# EAGLE design node (EAGLE 7.7.0)
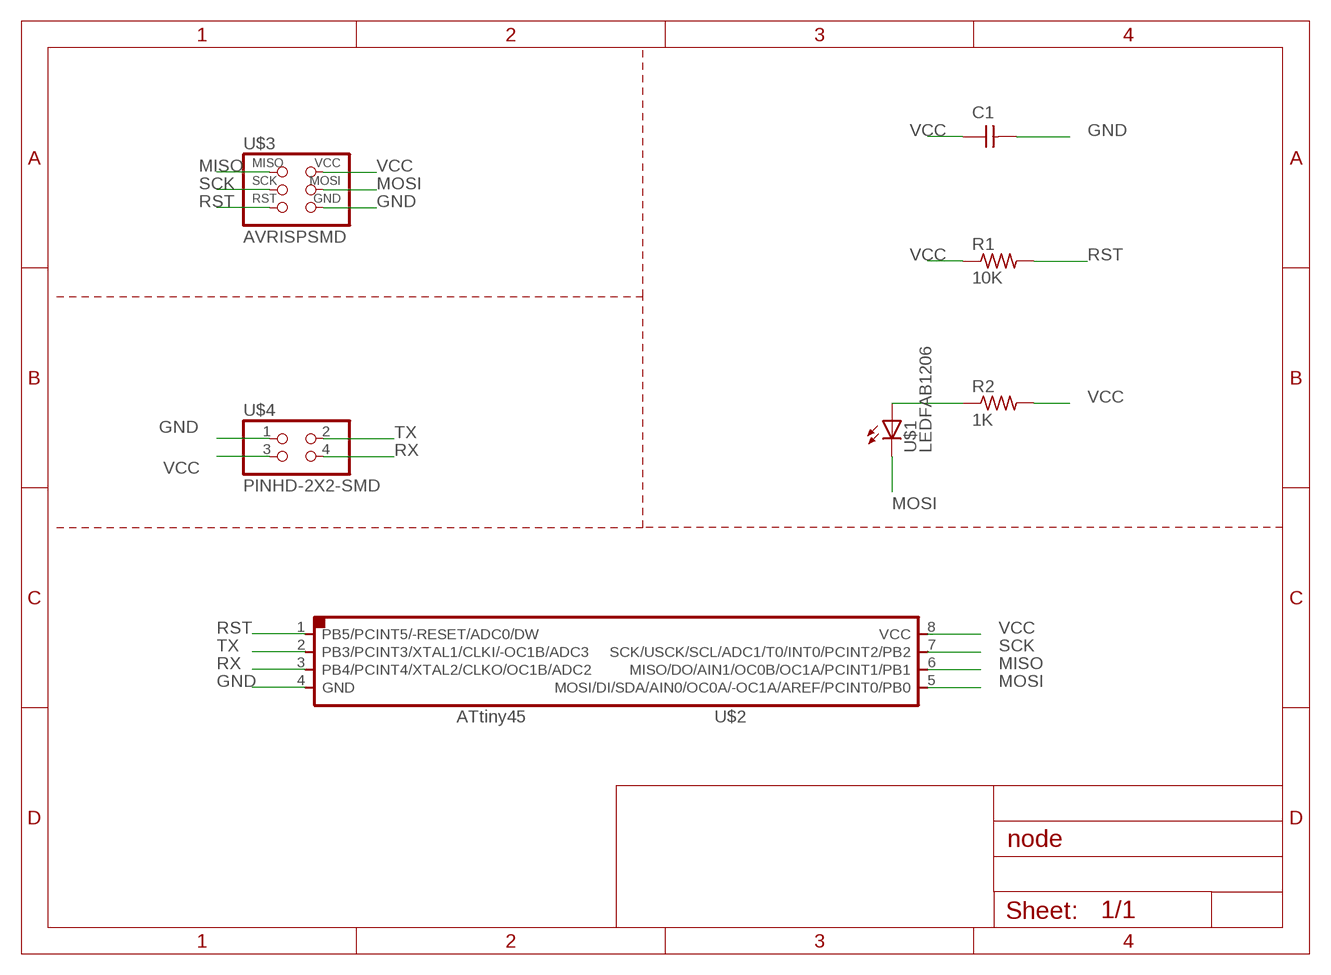
[diagram p0: schematic, sheet 1]

## Parts
C1  CAP-UNPOLARIZED  [C1206]
R1  10K  RES-US1206FAB  [R1206FAB]
R2  1K  RES-US1206FAB  [R1206FAB]
U$1  LEDFAB1206  [LED1206FAB]
U$2  ATTINY45SI  [SOIC8]
U$3  AVRISPSMD  [2X03SMD]
U$4  PINHD-2X2-SMD  [2X02SMD]

## Nets
GND: C1.2 U$2.4(GND) U$3.6(GND) U$4.1
MISO: U$2.6(MISO/DO/AIN1/OC0B/OC1A/PCINT1/PB1) U$3.1(MISO)
MOSI: U$1.2(C) U$2.5(MOSI/DI/SDA/AIN0/OC0A/-OC1A/AREF/PCINT0/PB0) U$3.4(MOSI)
N$1: R2.1 U$1.1(A)
RST: R1.2 U$2.1(PB5/PCINT5/-RESET/ADC0/DW) U$3.5(RST)
RX: U$2.3(PB4/PCINT4/XTAL2/CLKO/OC1B/ADC2) U$4.4
SCK: U$2.7(SCK/USCK/SCL/ADC1/T0/INT0/PCINT2/PB2) U$3.3(SCK)
TX: U$2.2(PB3/PCINT3/XTAL1/CLKI/-OC1B/ADC3) U$4.2
VCC: C1.1 R1.1 R2.2 U$2.8(VCC) U$3.2(VCC) U$4.3

## Library data of the parts
C1 = fab:CAP-UNPOLARIZED
R1 R2 = fab:RES-US: Resistor (US Symbol) Variants with postfix FAB are widened to allow the routing of internal traces
U$1 = fab:LED: LED
U$2 = fab:ATTINY45
U$3 = fab:AVRISP
U$4 = fab:PINHD-2X2-SMD

## Board
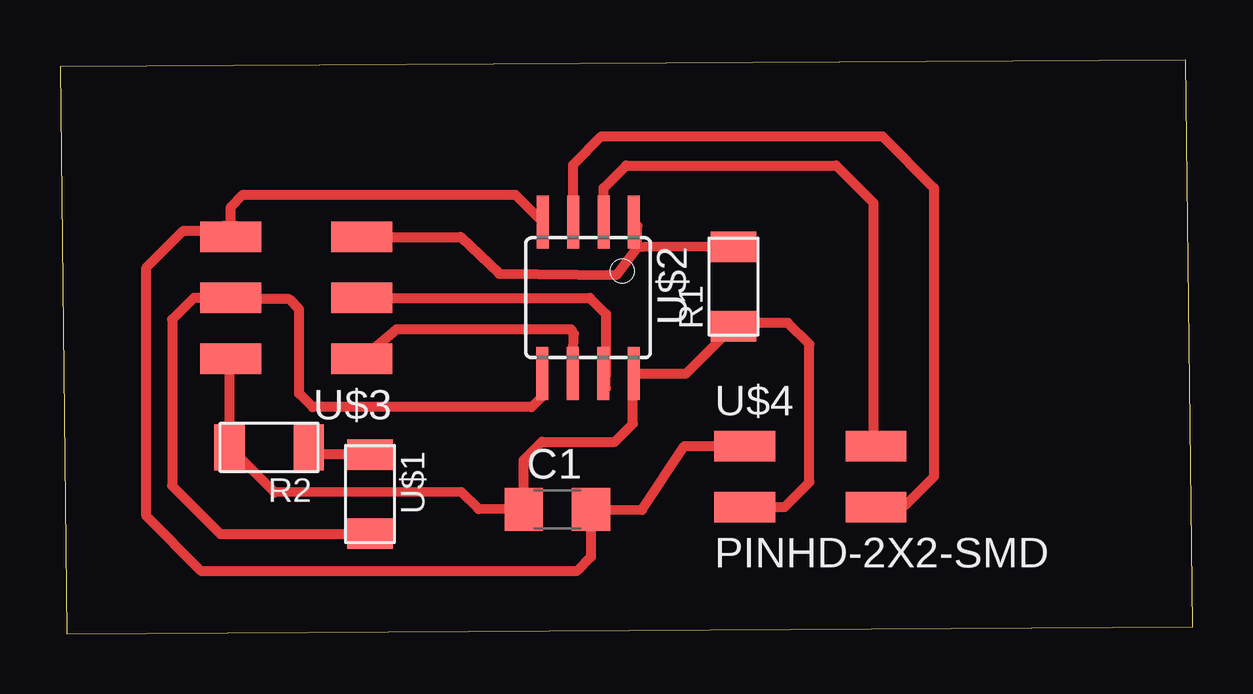
[diagram p1: board, top side]

Size 47.21 x 23.92 mm. Coordinates in mm from the lower left corner, seen from the top.
Outline: 0.29,0 47.21,0.29 46.92,23.92 0,23.63 0.29,0
Copper layers (1*16): Top 0.035mm / dielectric 1.5mm / Bottom 0.035mm
Design rules "default": minimum track width 10mil, minimum drill 24mil, track to track 8mil, track to pad 8mil, pad to pad 8mil, via to via 8mil, smd to smd 8mil, copper to edge 40mil, drill to drill 8mil, minimum pad ring 10mil, minimum via ring 8mil, stop-mask expansion 4mil, vias tented up to drill 0mil, thermal gap 10mil

### Footprints (pad centres in the part's own frame; a part is rotated, then mirrored left to right if it is on the bottom)
C1206 = smd 1.6 x 1.8: 1 -1.4,0; 2 1.4,0
R1206FAB = smd 1.27 x 1.905: 1 -1.651,0; 2 1.651,0
LED1206FAB = smd 1.27 x 1.905: 1 -1.651,0; 2 1.651,0
SOIC8 = smd 0.5 x 2.2: 1 -1.905,-3.154; 2 -0.645,-3.154; 3 0.625,-3.154; 4 1.895,-3.154; 5 1.905,3.154; 6 0.635,3.154; 7 -0.635,3.154; 8 -1.905,3.154
2X03SMD = smd 2.54 x 1.27: 1 -2.54,2.54; 2 2.92,2.54; 3 -2.54,0; 4 2.92,0; 5 -2.54,-2.54; 6 2.92,-2.54
2X02SMD = smd 2.54 x 1.27: 1 -2.54,1.27; 2 2.92,1.27; 3 -2.54,-1.27; 4 2.92,-1.27

### Placement (x,y rotation side)
C1  20.72,5.18 0 top
R1  28.06,14.47 90 top
R2  8.71,7.76 180 top
U$1  12.91,5.82 270 top
U$2  22,14 180 top
U$3  10.04,14 180 top
U$4  31.08,6.55 0 top

### Tracks (layer width: path | path; a pad name or v marks a point on that pad's centre or on a via)
GND
  Top 0.406: U$2.4 18.97,18.3 7.62,18.3 7.12,17.79 U$3.6 6.78,16.88 6.78,16.99 7.39,16.99 7.2,16.8 5.14,16.8 3.6,15.26 3.6,4.9 5.89,2.61 21.53,2.61 22.12,3.2 C1.2 24.24,5.16 26.01,7.82 U$4.1
MISO
  Top 0.406: U$2.6 21.41,12.5 21.29,12.69 14.03,12.69 U$3.1
MOSI
  Top 0.406: U$2.5 20.1,9.89 19.66,9.45 10.53,9.45 9.96,10.01 9.96,13.52 9.54,13.94 7.18,13.94 U$3.4 5.58,14 4.67,13.1 4.67,6.17 6.69,4.15 12.9,4.15 U$1.2
N$1
  Top 0.406: U$1.1 10.66,7.47 R2.1
RST
  Top 0.406: U$3.5 16.69,16.54 18.3,15.01 23.19,14.96 24.06,16.1 | 24.06,16.1 24.06,17.01 U$2.1 | R1.2 24.62,16.14 24.06,16.1
RX
  Top 0.406: U$2.3 21.38,19.55 22.56,20.73 34.26,20.73 36.42,18.58 36.42,6.54 35.25,5.37 34.09,5.37 U$4.4
SCK
  Top 0.406: U$3.3 22.08,14 22.75,13.33 22.75,10.74 | 22.75,10.24 22.75,10.74 | 22.75,10.74 U$2.7
TX
  Top 0.406: U$2.2 22.65,18.58 23.59,19.52 32.34,19.52 33.89,17.97 33.89,7.93 U$4.2
VCC
  Top 0.406: U$4.3 30.19,5.28 31.22,6.31 31.22,12.07 30.33,12.96 28.2,12.96 R1.1 26.1,10.85 U$2.8 23.87,10.81 23.87,8.74 23.12,7.99 20.08,7.99 19.32,7.24 C1.1 17.44,5.2 16.73,5.9 8.94,5.88 R2.2 7.06,11.4 U$3.2